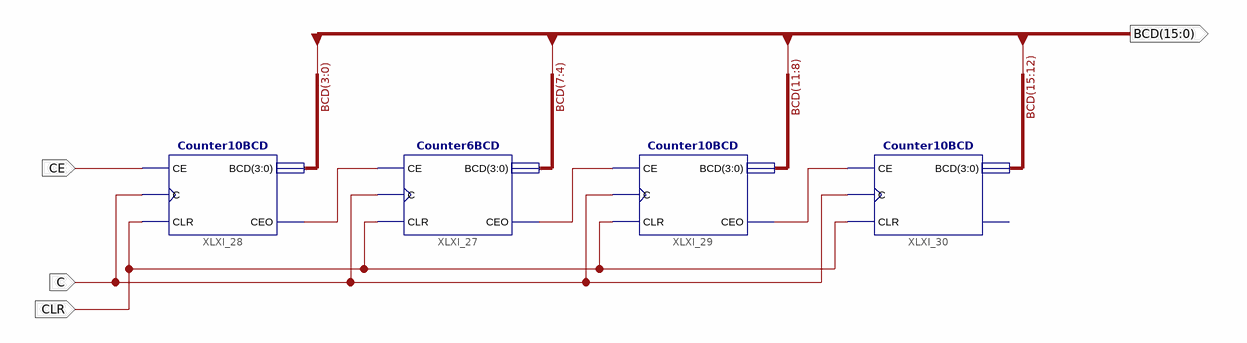
[diagram p0: schematic sheet 1]
// Xilinx ISE schematic Clock_Min_Sec.sch (spartan6) as structural Verilog: 4 symbols, 4 ports
module Clock_Min_Sec (
  input  CLR,
  input  CE,
  input  C,
  output [15:0] BCD
);

  wire XLXN_199, XLXN_201, XLXN_203;

  Counter6BCD XLXI_27 (.BCD(BCD[7:4]), .CEO(XLXN_201), .CE(XLXN_199), .C(C), .CLR(CLR));
  Counter10BCD XLXI_29 (.CE(XLXN_201), .C(C), .CLR(CLR), .CEO(XLXN_203), .BCD(BCD[11:8]));
  Counter10BCD XLXI_30 (.CE(XLXN_203), .C(C), .CLR(CLR), .BCD(BCD[15:12]));  // open: CEO
  Counter10BCD XLXI_28 (.CE(CE), .C(C), .CLR(CLR), .CEO(XLXN_199), .BCD(BCD[3:0]));
endmodule
